# EAGLE schematic PC Temperature Controller (EAGLE 6.5.0)
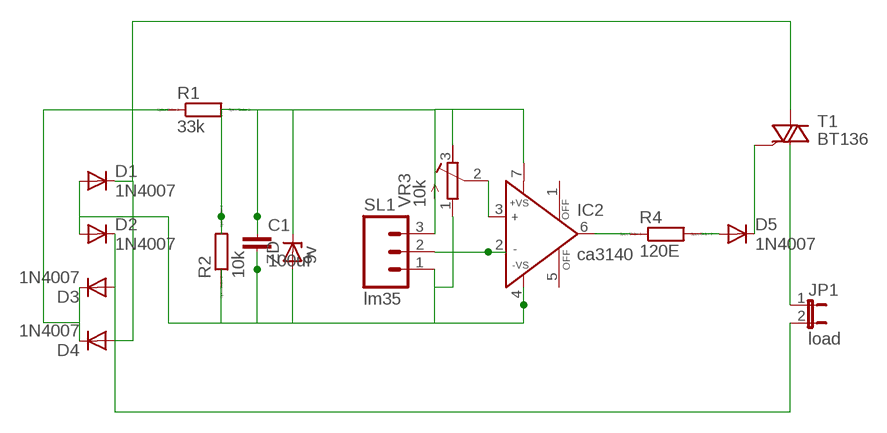
[diagram p0: schematic, sheet 1]

## Parts
C1  100uf  C2.5/4  [C2.5-4]
D1  1N4007  1N4004  [DO41-10]
D2  1N4007  1N4004  [DO41-10]
D3  1N4007  1N4004  [DO41-10]
D4  1N4007  1N4004  [DO41-10]
D5  1N4007  1N4004  [DO41-10]
IC2  ca3140  AD711N  [DIL08]
JP1  load  JP1E  [JP1]
R1  33k  R0204/7  [0204/7]
R2  10k  R0204/7  [0204/7]
R4  120E  R0204/7  [0204/7]
SL1  lm35  M03  [03P]
T1  BT136  [TO220AB]
VR3  10k  R-TRIMM64P  [RTRIM64P]
ZD  9v  ZENER-DIODEDO34-7  [DO34Z7]

## Nets
N$1: IC2.6(OUT) R4.1
N$2: D5.A R4.2
N$3: D5.C T1.3(G)
N$4: C1.2 D1.A D2.A IC2.4(-VS) R2.1 SL1.1 VR3.1(E) ZD.A
N$5: D3.C D4.C R1.1
N$6: D2.C D3.A JP1.2
N$7: D1.C D4.A T1.2(A2)
N$8: C1.1 IC2.7(+VS) R1.2 R2.2 SL1.3 VR3.3(A) ZD.C
N$9: IC2.3(IN+) VR3.2(S)
N$10: IC2.2(IN-) SL1.2
N$11: JP1.1 T1.1(A1)
Unconnected: IC2.1(OFF) IC2.5(OFF)

## Library data of the parts
C1 = capacitor-wima:C: CAPACITOR naming: grid - package width
D1-D5 = diode:1N4004: DIODE general purpose rectifier, 1 A
IC2 = analog-devices:AD711: Precision, Low Cost, High Speed, BiFET Op Amp Source: http://www.analog.com/static/imported-files/data_sheets/AD711.pdf; MPN: AD711BQ; OC_FARNELL: 9604839; OC_NEWARK: 66F5826
JP1 = jumper:JP1E: JUMPER
R1 R2 R4 = eagle-ltspice:R: RESISTOR, European symbol; SPICEMODEL: NONE; SPICEPREFIX: R
SL1 = con-amp-quick:M03: AMP QUICK CONNECTOR; OC_FARNELL: unknown; OC_NEWARK: unknown
T1 = triac:BT136: Triac BT136 series E sensitive gate Source: http://www.nxp.com/acrobat_download/datasheets/BT136_SERIES_E_2.pdf
VR3 = resistor:R-TRIMM: Trimm resistor
ZD = diode:ZENER-DIODE: Z-Diode